# Altium schematic sheet STN1110_RN-42.SchDoc: STN1110 RN-42 Bluetooth Board
size B; DrawnBy: AHonecker; Organization: AH Design; Address1: Designed and; Address2: Produced in NY; Address3: USA; DocumentNumber: 1; Revision: 1; SheetNumber: 1; SheetTotal: 2
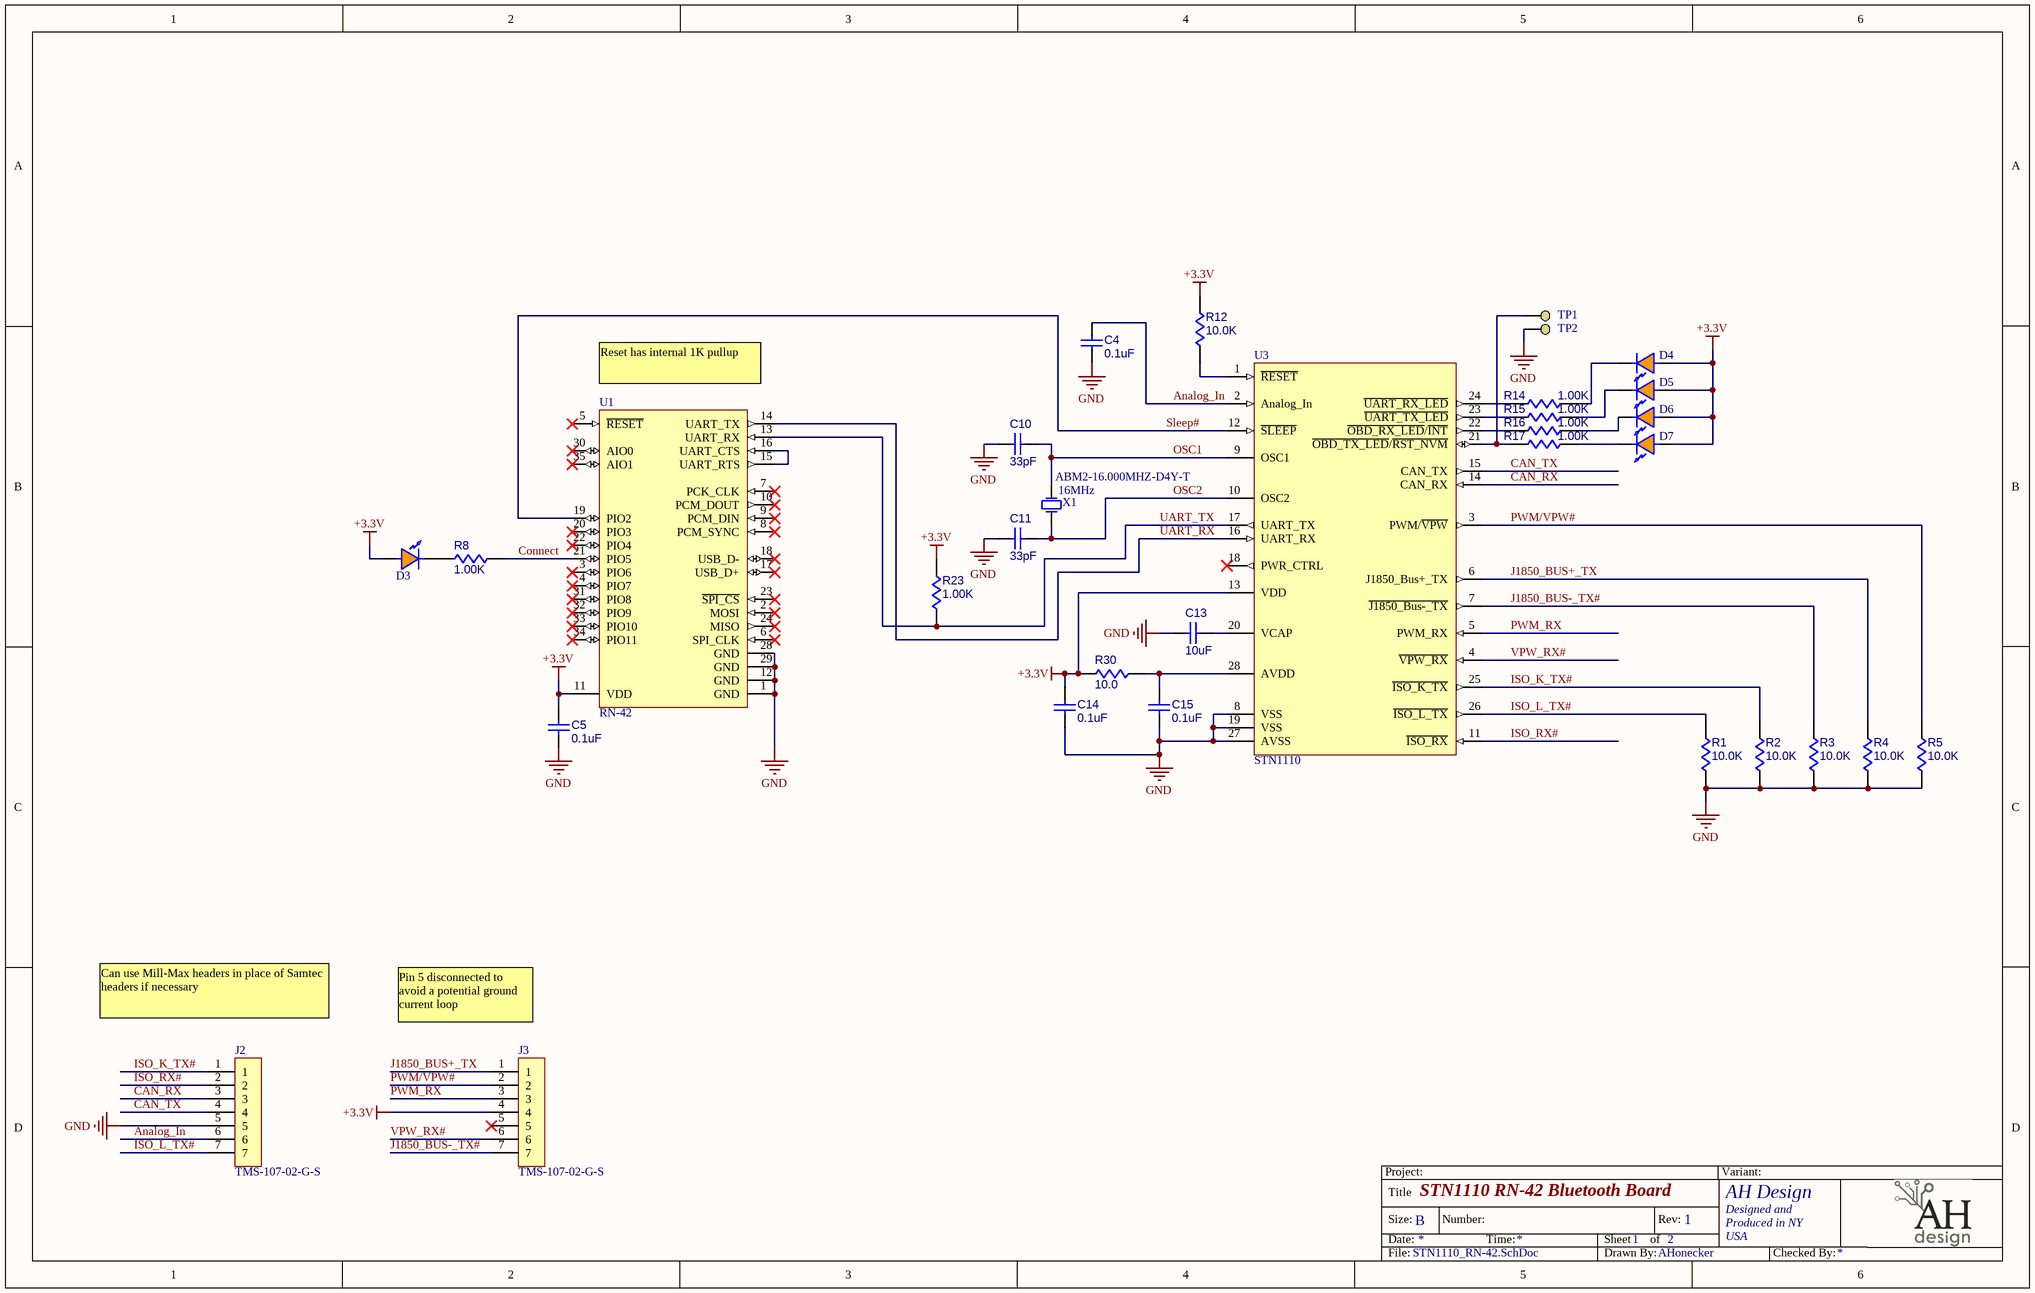
[diagram p0: STN1110_RN-42.SchDoc]

## Parts
C4  0.1uF  [CC0603]
C5  0.1uF  [CC0603]
C10  33pF  [CC0603]
C11  33pF  [CC0603]
C13  10uF  [CC0805]
C14  0.1uF  [CC0603]
C15  0.1uF  [CC0603]
D3  APA1606SECK  [KINGBRIGHT_APA1606SECK]  (value not drawn)
D4  APA1606SECK  [KINGBRIGHT_APA1606SECK]  (value not drawn)
D5  APA1606SECK  [KINGBRIGHT_APA1606SECK]  (value not drawn)
D6  APA1606SECK  [KINGBRIGHT_APA1606SECK]  (value not drawn)
D7  APA1606SECK  [KINGBRIGHT_APA1606SECK]  (value not drawn)
J2  TMS-107-02-G-S  [Samtec_TMS-107-02-G-S]
J3  TMS-107-02-G-S  [Samtec_TMS-107-02-G-S]
R1  10.0K  [R0603]
R2  10.0K  [R0603]
R3  10.0K  [R0603]
R4  10.0K  [R0603]
R5  10.0K  [R0603]
R8  1.00K  [R0603]
R12  10.0K  [R0603]
R14  1.00K  [R0603]
R15  1.00K  [R0603]
R16  1.00K  [R0603]
R17  1.00K  [R0603]
R23  1.00K  [R0603]
R30  10.0  [R0603]
TP1  (no value)  [TP,0.5mmx0.5mm,RND]  (no BOM)
TP2  (no value)  [TP,0.5mmx0.5mm,RND]  (no BOM)
U1  RN-42  [RN-42]
U3  STN1110  [SOIC127P1030X264-28N]
X1  ABM2-16.000MHZ-D4Y-T  value 16MHz  [Abracon_ABM2_Series]

## Nets
+3.3V: C5.1 C14.1 D3.A D4.A D5.A D6.A D7.A J3.4 R12.2 R23.2 R30.1 U1.11(VDD) U3.13(VDD)
GND: C4.1 C5.2 C10.1 C11.1 C13.2 C14.2 C15.2 J2.5 R1.2 R2.2 R3.2 R4.2 R5.2 TP2.1(TP) U1.1(GND) U1.12(GND) U1.28(GND) U1.29(GND) U3.8(VSS) U3.19(VSS) U3.27(AVSS)
Analog_In: C4.2 J2.6 U3.2(Analog_In)
CAN_RX: J2.3 U3.14(CAN_RX)
CAN_TX: J2.4 U3.15(CAN_TX)
Connect: R8.1 U1.21(PIO5)
ISO_K_TX#: J2.1 R2.1 U3.25(~{ISO_K_TX})
ISO_L_TX#: J2.7 R1.1 U3.26(~{ISO_L_TX})
ISO_RX#: J2.2 U3.11(~{ISO_RX})
J1850_BUS+_TX: J3.1 R4.1 U3.6(J1850_Bus+_TX)
J1850_BUS-_TX#: J3.7 R3.1 U3.7(~{J1850_Bus-_TX})
OSC1: C10.2 U3.9(OSC1) X1.2(OSC2)
OSC2: C11.2 U3.10(OSC2) X1.1(OSC1)
PWM/VPW#: J3.2 R5.1 U3.3(PWM/~{VPW})
PWM_RX: J3.3 U3.5(PWM_RX)
Sleep#: U1.19(PIO2) U3.12(~{SLEEP})
UART_RX: U1.14(UART_TX) U3.16(UART_RX)
UART_TX: R23.1 U1.13(UART_RX) U3.17(UART_TX)
VPW_RX#: J3.6 U3.4(~{VPW_RX})
NetC13_1: C13.1 U3.20(VCAP)
NetC15_1: C15.1 R30.2 U3.28(AVDD)
NetD3_C: D3.C R8.2
NetD4_C: D4.C R14.1
NetD5_C: D5.C R15.1
NetD6_C: D6.C R16.1
NetD7_C: D7.C R17.1
NetR12_1: R12.1 U3.1(~{RESET})
NetR14_2: R14.2 U3.24(~{UART_RX_LED})
NetR15_2: R15.2 U3.23(~{UART_TX_LED})
NetR16_2: R16.2 U3.22(~{OBD_RX_LED}/~{INT})
NetR17_2: R17.2 TP1.1(TP) U3.21(~{OBD_TX_LED}/~{RST_NVM})
NetU1_15: U1.15(UART_RTS) U1.16(UART_CTS)

Not connected (* = marked no-connect by the designer): J3 5*; U1 2(MOSI)* 3(PIO6)* 4(PIO7)* 5(~{RESET})* 6(SPI_CLK)* 7(PCK_CLK)* 8(PCM_SYNC)* 9(PCM_DIN)* 10(PCM_DOUT)* 17(USB_D+)* 18(USB_D-)* 20(PIO3)* 22(PIO4)* 23(~{SPI_CS})* 24(MISO)* 30(AIO0)* 31(PIO8)* 32(PIO9)* 33(PIO10)* 34(PIO11)* 35(AIO1)*; U3 18(PWR_CTRL)*

## Notes on the sheet
- (near U1) Reset has internal 1K pullup
- Can use Mill-Max headers in place of Samtec headers if necessary
- (near J3) Pin 5 disconnected to avoid a potential ground current loop
- Project:
- Variant:
- Title
- Size:
- Date:
- B
- Number:
- Time:
- Sheet
- of
- Rev:
- File:
- Drawn By:
- Checked By:

## Library data of the parts
C4 C5 C14 C15 = 0.1uF,50V,CC0603,X7R,+/-20%: 0.1uF 50V, in a CC0603, X7R ,+/-20%,LF; Manufacturer: Kemet; PartNumber: C0603C104M5RAC; Voltage: 50; Designator: C?; Component Subkind: Capacitor; Approved: Pending; Value: 0.1uF; LeadFree: Yes; RoHS: Yes; Published: 7/18/2007; Publisher: AltiumdBManager; ItemID: 0.1uF,50V,CC0603,X7R,+/-20%; Component Kind: Standard; Component Type: Standard; Manufacturer2: CAL-CHIP; Manufacturer3: -; Manufacturer4: -; Pin Count: 2; PartNumber2: GMC10X7R10450NT-LF; Material: X7R; Tolerance: +/-20%; ComponentLink1URL: \PassivesDatasheets\F3102_CE.pdf; ComponentLink2URL: \PassivesDatasheets\gmc_series.pdf; ComponentLink3URL: -; ComponentLink4URL: -; ComponentLink1Description: Datasheet; ComponentLink2Description: Datasheet; ComponentLink3Description: Datasheet; ComponentLink4Description: Datasheet
C10 C11 = 33pF,16V,CC0603,COG,+/-1%: 33pF 16V, in a CC0603, COG ,+/-1%,LF; Manufacturer: Kemet Electronics Corp; PartNumber: C0603C330F4GAC; PartStatus1: Active; Voltage: 16; Designator: C?; Component Subkind: Capacitor; Approved: Yes; ItemWeight1_mg: 291.799987792969; ItemWeight2_mg: 0; Approver: IHS; Value: 33pF; LeadFree: Yes; RoHS: Yes; Published: 1/5/2011 12:10:52 PM; Publisher: AltiumDBManager1.4-MWyman; ItemID: 33pF,16V,CC0603,COG,+/-1%; Component Kind: Standard; Component Type: Standard; Manufacturer2: -; Manufacturer3: -; Manufacturer4: -; Pin Count: 2; Material: COG; Tolerance: +/-1%; Status: Active; ComponentLink1URL: \PassivesDatasheets\F3102_CE.pdf; ComponentLink2URL: -; ComponentLink3URL: -; ComponentLink4URL: -; ComponentLink1Description: Datasheet; ComponentLink2Description: Datasheet; ComponentLink3Description: Datasheet; ComponentLink4Description: Datasheet; PartNumber2: -; PartNumber3: -; PartNumber4: -; PartStatus2: -; PartStatus3: -; PartStatus4: -; ItemWeight3_mg: 0; ItemWeight4_mg: 0
C13 = 10uF,6.3V,CC0805,X5R,+/-20%: 10uF 6.3V, in a CC0805, X5R ,+/-20%,LF; Manufacturer: Kemet Electronics Corp; PartNumber: C0805C106M9PAC; PartStatus1: Active; Voltage: 6.3; Designator: C?; Component Subkind: Capacitor; Approved: Yes; ItemWeight1_mg: 21.1817970275879; ItemWeight2_mg: 0; Approver: IHS; Value: 10uF; LeadFree: Yes; RoHS: Yes; Published: 1/5/2011 12:04:51 PM; Publisher: AltiumDBManager1.4-MWyman; ItemID: 10uF,6.3V,CC0805,X5R,+/-20%; Component Kind: Standard; Component Type: Standard; Manufacturer2: Cal-Chip Electronics; Manufacturer3: Yageo Corp; Manufacturer4: -; Pin Count: 2; Material: X5R; Tolerance: +/-20%; Status: Active; ComponentLink1URL: \PassivesDatasheets\F3102_CE.pdf; ComponentLink2URL: \PassivesDatasheets\gmc_series.pdf; ComponentLink3URL: \PassivesDatasheets\PSG_2006.pdf; ComponentLink4URL: -; ComponentLink1Description: Datasheet; ComponentLink2Description: Datasheet; ComponentLink3Description: Datasheet; ComponentLink4Description: Datasheet; PartNumber4: -; PartStatus4: -; ItemWeight3_mg: 0; ItemWeight4_mg: 0
D3-D7 = KINGBRIGHT_APA1606SECK: LED 1.6X0.6MM 601NM Orange Right-Angle SMD; Manufacturer: Kingbright Corp.; Approved: No; TargetLibrary: LEDs; Value: 2.1V; ComponentLink1Description: Datasheet; ComponentLink1URL: http://www.us.kingbright.com/images/catalog/SPEC/APA1606SECK.pdf; LeadFree: Yes; PartNumber: APA1606SECK; Published: 1/18/2010; Publisher: Vanteon - AHonecker; RoHS: Yes; Status: Active
J2 J3 = Samtec_TMS-107-02-G-S: 7 pin through hole micro header, 50mil pitch; Manufacturer: Samtec; PartNumber: TMS-107-02-G-S
R1-R5 R12 = 10.0K,R0603,1%: 10.0K, Gen Purp Chip, R0603 0.1W 1%; Manufacturer: Panasonic; PartNumber: ERJ3EKF1002V; Component SubKind: Resistor; Voltage: 75; MetricFootprint: R1608MM; Value: 10.0K; Manufacturer2: Vishay/Dale; Manufacturer3: KOA/Speer; Manufacturer4: ROHM; PartNumber2: CRCW060310K0FKED; PartNumber3: RK73H1JTTD1002F; PartNumber4: MCR03EZPFX1002; Tolerance: 1%; Material: Thick-Film; Watts: 0.1W; LeadFree: Yes; RoHS: Yes; Published: 7/16/2009; Publisher: AltiumDBManager1.1; ItemID: 10.0K,R0603,1%; Component Kind: Standard; Component Type: Standard; Pin Count: 2; Spice Prefix: R; ComponentLink1URL: http://industrial.panasonic.com/www-data/pdf/AOA0000/AOA0000CE2.pdf; ComponentLink2URL: \PassivesDatasheets\Vishay_dcrcw.pdf; ComponentLink3URL: \PassivesDatasheets\KOA_Speer_1%_0p5%.pdf; ComponentLink4URL: \PassivesDatasheets\mcr03.pdf; ComponentLink1Description: Datasheet; ComponentLink2Description: Datasheet; ComponentLink3Description: Datasheet; ComponentLink4Description: Datasheet
R8 R23 = 1.00K,R0603,1%: 1.00K, Gen Purp Chip, R0603 0.1W 1%; Manufacturer: Panasonic; PartNumber: ERJ3EKF1001V; Component SubKind: Resistor; Voltage: 75; MetricFootprint: R1608MM; Value: 1.00K; Manufacturer2: Vishay/Dale; Manufacturer3: KOA/Speer; Manufacturer4: ROHM; PartNumber2: CRCW06031K00FKED; PartNumber3: RK73H1JTTD1001F; PartNumber4: MCR03EZPFX1001; Tolerance: 1%; Material: Thick-Film; Watts: 0.1W; LeadFree: Yes; RoHS: Yes; Published: 7/16/2009; Publisher: AltiumDBManager1.1; ItemID: 1.00K,R0603,1%; Component Kind: Standard; Component Type: Standard; Pin Count: 2; Spice Prefix: R; ComponentLink1URL: http://industrial.panasonic.com/www-data/pdf/AOA0000/AOA0000CE2.pdf; ComponentLink2URL: \PassivesDatasheets\Vishay_dcrcw.pdf; ComponentLink3URL: \PassivesDatasheets\KOA_Speer_1%_0p5%.pdf; ComponentLink4URL: \PassivesDatasheets\mcr03.pdf; ComponentLink1Description: Datasheet; ComponentLink2Description: Datasheet; ComponentLink3Description: Datasheet; ComponentLink4Description: Datasheet
R14-R17 = 1.00k,R0603,1%: 1.00K, Gen Purp Chip, R0603 0.1W 1%; Manufacturer: Panasonic; PartNumber: RK73H1JTTD1001F; PartStatus1: Active; Component SubKind: Resistor; Voltage: 75; MetricFootprint: R1608MM; Approved: Yes; Note: Scrubbed by IHS; ItemWeight1_mg: 2.14438605308533; ItemWeight2_mg: 2.14000010490417; ItemWeight4_mg: 2.11999988555908; Approver: IHS; Value: 1.00K; Manufacturer2: Koa Speer Electronics Inc; Manufacturer3: Koa Speer Electronics Inc; Manufacturer4: Rohm Co Ltd; PartNumber2: CRCW06031K00FKED; PartNumber3: RK73H1JTTD1001F; PartNumber4: MCR03EZPFX1001; Tolerance: 1%; Material: Thick-Film; Watts: 0.1W; LeadFree: Yes; RoHS: Yes; Published: 1/5/2011 3:08:25 PM; Publisher: AltiumDBManager1.4-MWyman; ItemID: 1.00K,R0603,1%; Component Kind: Standard; Component Type: Standard; Pin Count: 2; Spice Prefix: R; Status: Active; ComponentLink1URL: http://industrial.panasonic.com/www-data/pdf/AOA0000/AOA0000CE2.pdf; ComponentLink2URL: -; ComponentLink3URL: \PassivesDatasheets\KOA_Speer_1%_0p5%.pdf; ComponentLink4URL: \PassivesDatasheets\mcr03.pdf; ComponentLink1Description: Datasheet; ComponentLink2Description: N/A; ComponentLink3Description: Datasheet; ComponentLink4Description: Datasheet; PartStatus2: Active; PartStatus3: Active; PartStatus4: Active; ItemWeight3_mg: 2.14000010490417
R30 = 10.0,R0603,1%: 10.0, Gen Purp Chip, R0603 0.1W 1%; Manufacturer: Panasonic; PartNumber: ERJ3EKF10R0V; Component SubKind: Resistor; Voltage: 75; MetricFootprint: R1608MM; Value: 10.0; Manufacturer2: Vishay/Dale; Manufacturer3: KOA/Speer; Manufacturer4: ROHM; PartNumber2: CRCW060310R0FKED; PartNumber3: RK73H1JTTD10R0F; PartNumber4: MCR03EZPFX10R0; Tolerance: 1%; Material: Thick-Film; Watts: 0.1W; LeadFree: Yes; RoHS: Yes; Published: 7/16/2009; Publisher: AltiumDBManager1.1; ItemID: 10.0,R0603,1%; Component Kind: Standard; Component Type: Standard; Pin Count: 2; Spice Prefix: R; ComponentLink1URL: http://industrial.panasonic.com/www-data/pdf/AOA0000/AOA0000CE2.pdf; ComponentLink2URL: \PassivesDatasheets\Vishay_dcrcw.pdf; ComponentLink3URL: \PassivesDatasheets\KOA_Speer_1%_0p5%.pdf; ComponentLink4URL: \PassivesDatasheets\mcr03.pdf; ComponentLink1Description: Datasheet; ComponentLink2Description: Datasheet; ComponentLink3Description: Datasheet; ComponentLink4Description: Datasheet
TP1 TP2 = TP, 0.5mm x 0.5mm SMT, RND: 0.5mm diameter testpoint
U1 = RN-42: Roving Networks Bluetooth Serial Module; Manufacturer: Roving Networks; PartNumber: RN-42
U3 = STN1110_SOIC: ELM327 Improved Replacement; Multiprotocol OBDII Scanner; Manufacturer: ScanTool.net; PartNumber: STN1110
X1 = ABM2-16.000MHZ-D4Y-T: CRYSTAL 16.00 MHZ 18PF SMD; Manufacturer: Abracon; PartNumber: ABM2-16.000MHZ-D4Y-T